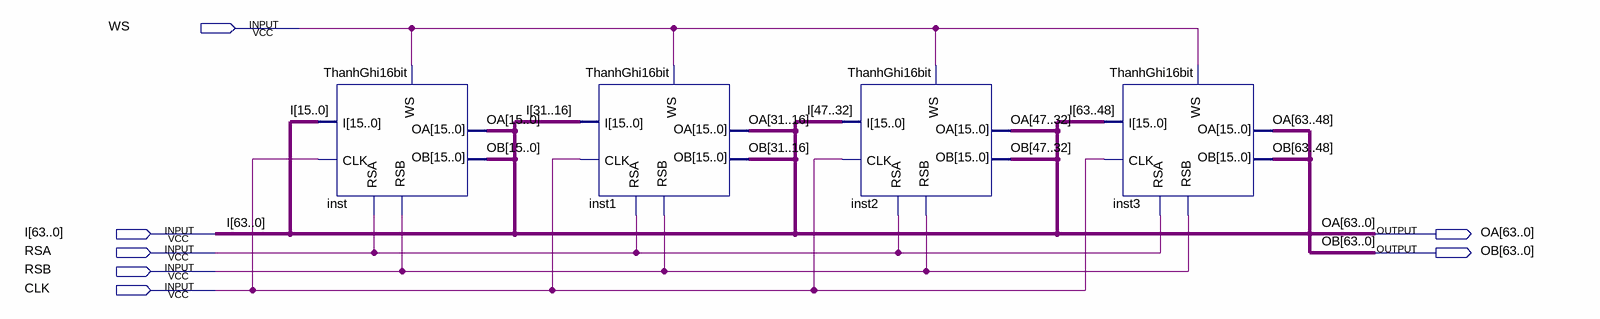
[diagram p0: schematic sheet]
// Quartus schematic REG_64bits.bdf as structural Verilog: 4 symbols, 7 pins
module REG_64bits (
  input  WS,
  input  [63:0] I,
  input  RSA,
  input  RSB,
  input  CLK,
  output [63:0] OA,
  output [63:0] OB
);

  ThanhGhi16bit inst (.I(I[15:0]), .WS(WS), .RSA(RSA), .RSB(RSB), .CLK(CLK), .OA(OA[15:0]), .OB(OB[15:0]));
  ThanhGhi16bit inst1 (.I(I[31:16]), .WS(WS), .RSA(RSA), .RSB(RSB), .CLK(CLK), .OA(OA[31:16]), .OB(OB[31:16]));
  ThanhGhi16bit inst2 (.I(I[47:32]), .WS(WS), .RSA(RSA), .RSB(RSB), .CLK(CLK), .OA(OA[47:32]), .OB(OB[47:32]));
  ThanhGhi16bit inst3 (.I(I[63:48]), .WS(WS), .RSA(RSA), .RSB(RSB), .CLK(CLK), .OA(OA[63:48]), .OB(OB[63:48]));
endmodule
